# EAGLE schematic SystemeAlarme (EAGLE 6.5.0)
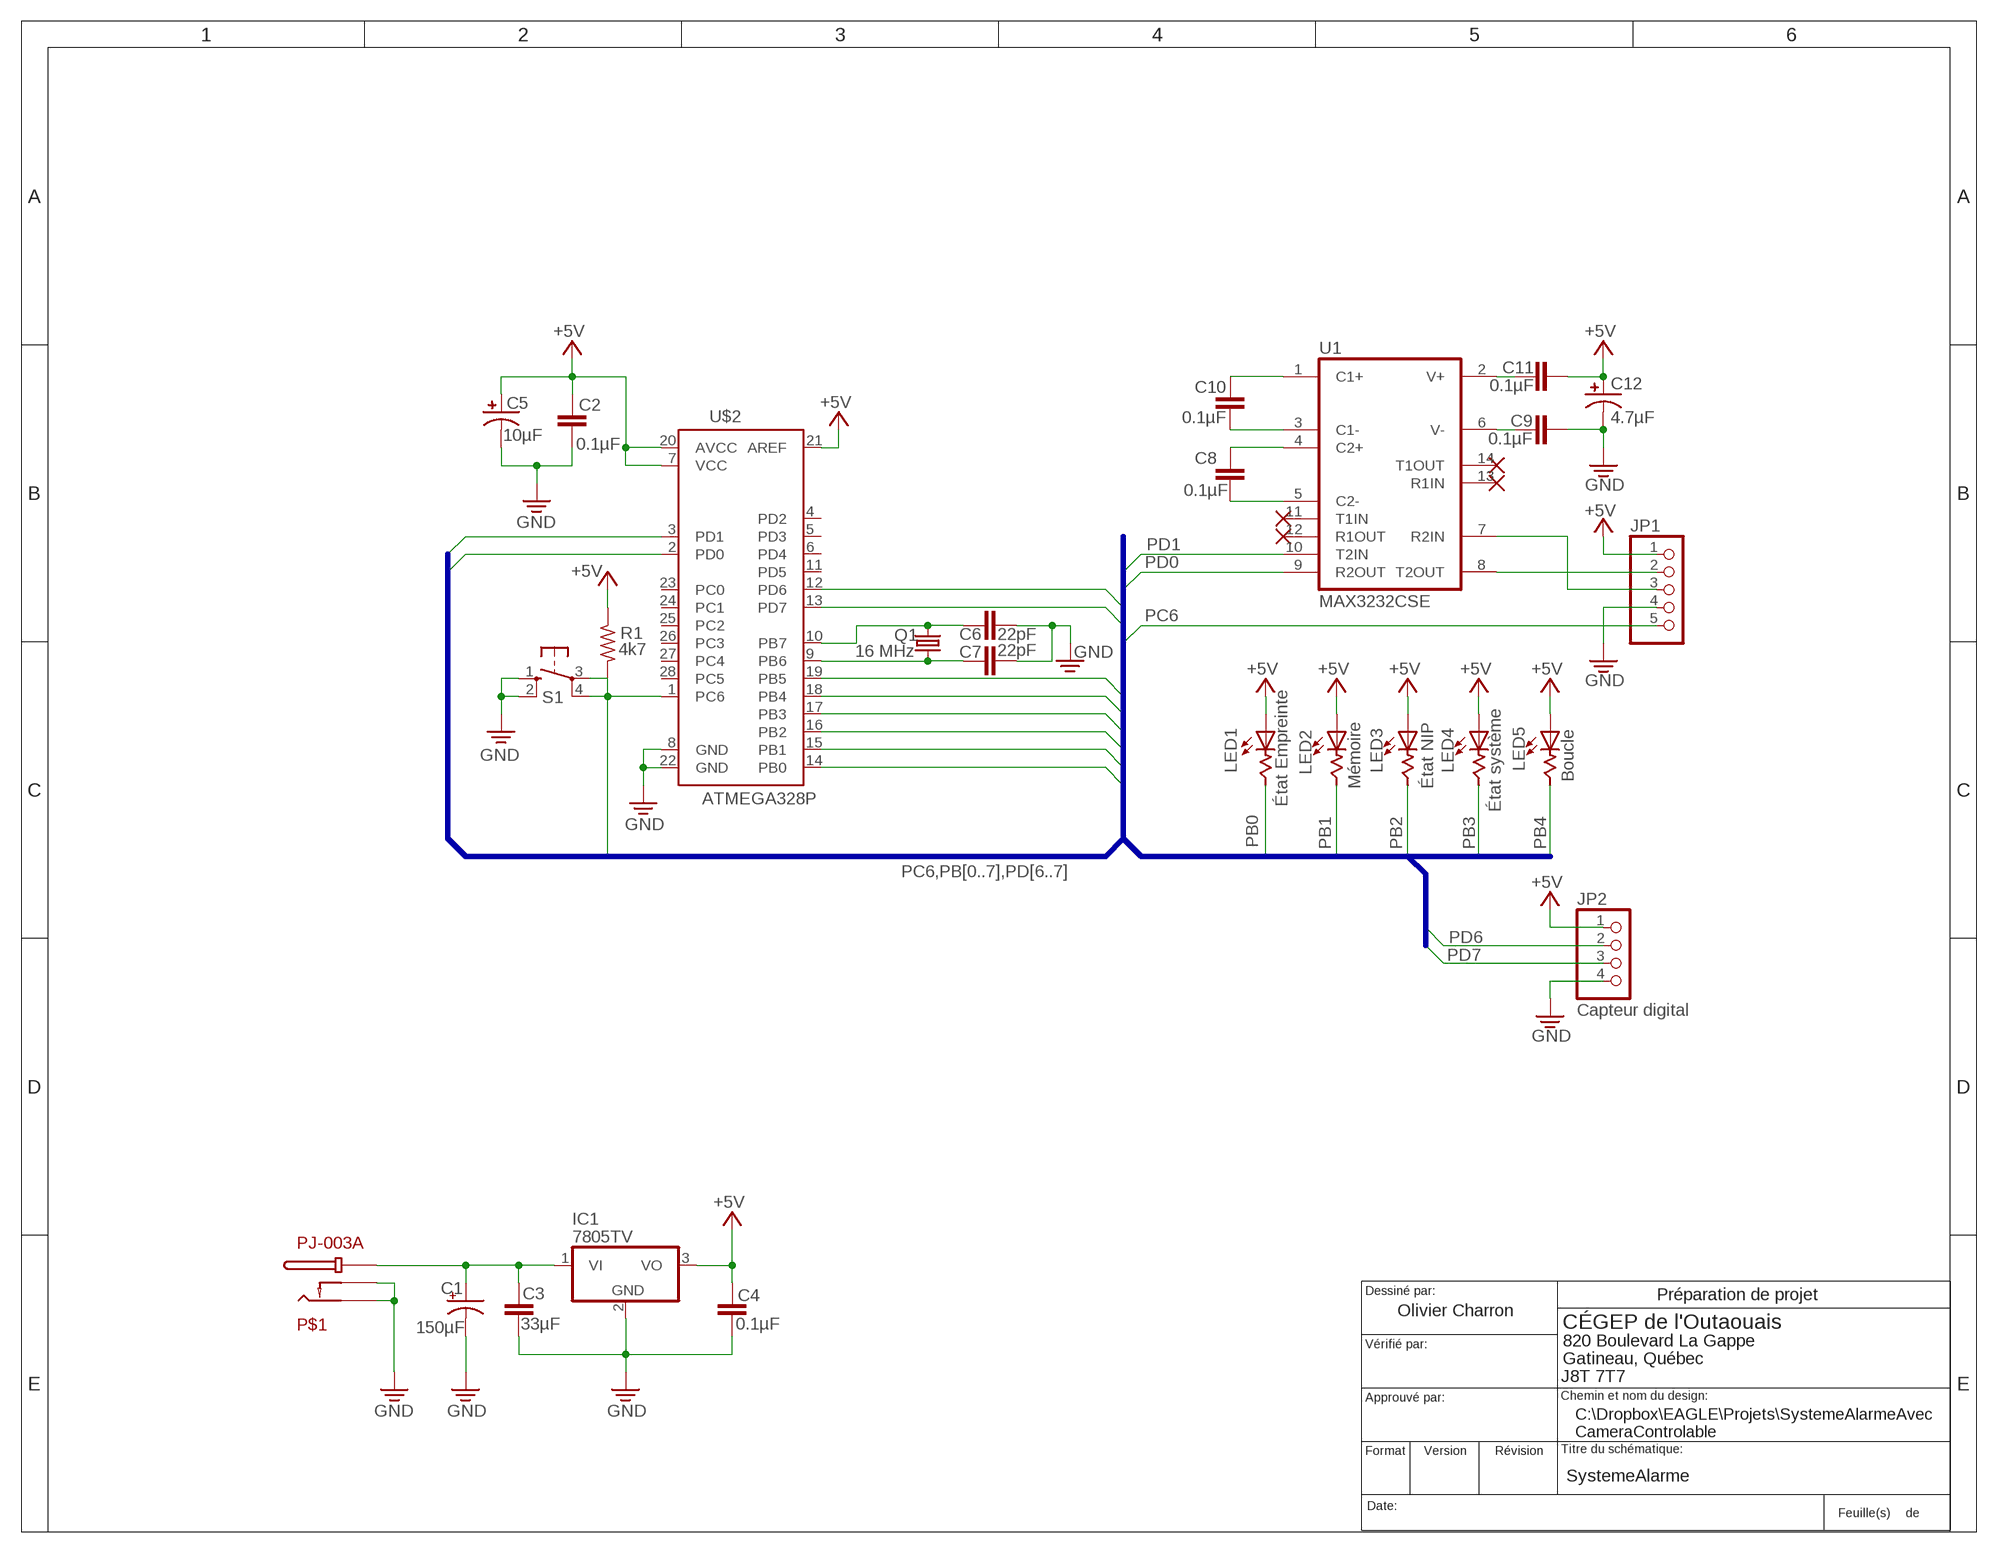
[diagram p0: schematic, sheet 1]

## Parts
C1  150µF  CPOL-USD/7343-31R  [D/7343-31R]
C2  0.1µF  C-EUC1210  [C1210]
C3  33µF  C-EUC0805  [C0805]
C4  0.1µF  C-EUC0805  [C0805]
C5  10µF  C-USC1206  [C1206]
C6  22pF  C-EUC1210  [C1210]
C7  22pF  C-EUC1210  [C1210]
C8  0.1µF  C-EUC0805  [C0805]
C9  0.1µF  C-EUC0805  [C0805]
C10  0.1µF  C-EUC0805  [C0805]
C11  0.1µF  C-EUC0805  [C0805]
C12  4.7µF  C-USC0805  [C0805]
FRAME1  CARTOUCHE_TGÉ  [CARTOUCHE]
IC1  7805TV  [TO220V]
JP1  PINHD-1X5  [1X05]
JP2  Capteur digital  PINHD-1X4  [1X04]
LED1  État Empreinte  LED3MM  [LED3MM]
LED2  Mémoire  LED3MM  [LED3MM]
LED3  État NIP  LED3MM  [LED3MM]
LED4  État système  LED3MM  [LED3MM]
LED5  Boucle  LED3MM  [LED3MM]
P$1  PJ-003A  [PJ-003A-FP]
Q1  16 MHz  CRYSTALHC49S  [HC49/S]
R1  4k7  R-US_M1206  [M1206]
S1  10-XX  [B3F-10XX]
U1  MAX3232CSE  [SO16]
U$2  ATMEGA328P  [DIL32]

## Nets
+5V: C2.2 C4.1 C5.1 C11.1 C12.1 IC1.3(VO) JP1.1 JP2.1 LED1.A LED2.A LED3.A LED4.A LED5.A R1.1 U$2.7(VCC) U$2.20(AVCC) U$2.21(AREF)
GND: C1.- C3.2 C4.2 C6.1 C7.1 C9.2 C12.2 IC1.2(GND) JP1.4 P$1.P$2(GND) P$1.P$3(GND) S1.1(S) S1.2(S1) U$2.8(GND) U$2.22(GND)
N$1: C1.+ C3.1 IC1.1(VI) P$1.P$1(+DCIN)
N$6: C10.1 U1.1(C1+)
N$7: C10.2 U1.3(C1-)
N$8: C8.1 U1.4(C2+)
N$9: C8.2 U1.5(C2-)
N$10: C9.1 U1.6(V-)
N$11: C11.2 U1.2(V+)
N$12: JP1.3 U1.7(R2IN)
N$20: JP1.2 U1.8(T2OUT)
N$22: C2.1 C5.2 ; supply symbol labelled GND
N$25: C6.2 Q1.1 U$2.10(PB7)
N$26: C7.2 Q1.2 U$2.9(PB6)
PB0: LED1.K(C) U$2.14(PB0)
PB1: LED2.K(C) U$2.15(PB1)
PB2: LED3.K(C) U$2.16(PB2)
PB3: LED4.K(C) U$2.17(PB3)
PB4: LED5.K(C) U$2.18(PB4)
PB5: U$2.19(PB5)
PC6: JP1.5 R1.2 S1.3(P) S1.4(P1) U$2.1(PC6)
PD0: U1.9(R2OUT) U$2.2(PD0)
PD1: U1.10(T2IN) U$2.3(PD1)
PD6: JP2.2 U$2.12(PD6)
PD7: JP2.3 U$2.13(PD7)
PE: JP2.4 ; supply symbol labelled GND
Unconnected: U1.11(T1IN) U1.12(R1OUT) U1.13(R1IN) U1.14(T1OUT) U$2.4(PD2) U$2.5(PD3) U$2.6(PD4) U$2.11(PD5) U$2.23(PC0) U$2.24(PC1) U$2.25(PC2) U$2.26(PC3) U$2.27(PC4) U$2.28(PC5)

## Buses
PC6,PB[0..7],PD[6..7]

## Notes on the sheet
- Écran tactile
- Capteur magnétique | Indicateurs lumineux
- Microcontrôleur | Tourelle
- Interrupteur
       à clé
- Sirène
- Lecteur d'empreinte 
           digitale
- Joystick
- Moniteur
- Ordinateur
- Caméra
- Préparation de projet
- C:\\Dropbox\\EAGLE\\Projets\\SystemeAlarmeAvec
  CameraControlable

## Power pins joined to a net without a drawn wire
GND: U1.15(GND)
VCC: U1.16(VCC)

## Library data of the parts
C1 = rcl:CPOL-US: POLARIZED CAPACITOR, American symbol
C2-C4 C6-C11 = rcl:C-EU: CAPACITOR, European symbol
C5 C12 = rcl:C-US: CAPACITOR, American symbol
FRAME1 = 1_TGE-sur G:CARTOUCHE_TGÉ: Cartouche de TGÉ: Grandeur A, dimention 8 1/2 x 11 pouces, orientation portrait. Les élèves doivent utiliser la commande TEXT pour placer les valeurs aux champs appropriés. Couche 100 Cartouche, ne pas oublier de créer cette couche! Size par défaut: 0,07 ou ajusté en conséquence si pas asez d'espace. Ratio: 8% Font: Vector. Voir la commande TEXT pour plus d'information.
IC1 = linear:78*: Positive VOLTAGE REGULATOR Source: http://cache.national.com/ds/LM/LM78L05.pdf http://www.fairchildsemi.com/ds/LM/LM7805.pdf
JP1 = pinhead:PINHD-1X5: PIN HEADER
JP2 = 1mylib:PINHD-1X4: PIN HEADER
LED1-LED5 = led:LED: LED OSRAM: - CHIPLED LG R971, LG N971, LY N971, LG Q971, LY Q971, LO R971, LY R971 LH N974, LH R974 LS Q976, LO Q976, LY Q976 LO Q996 - Hyper CHIPLED LW Q18S LB Q993, LB Q99A, LB R99A - SideLED LS A670, LO A670, LY A670, LG A670, LP A670 LB A673, LV A673, LT A673, LW A673 LH A674 LY A675 LS A676, LA A676, LO A676, LY A676, LW A676 LS A679, LY A679, LG A679 - Hyper Micro SIDELED® LS Y876, LA Y876, LO Y876, LY Y876 LT Y87S - SmartLED LW L88C, LW L88S LB L89C, LB L89S, LG L890 LS L89K, LO L89K, LY L89K LS L896, LA L896, LO L896, LY L896 - TOPLED LS T670, LO T670, LY T670, LG T670, LP T670 LSG T670, LSP T670, LSY T670, LOP T670, LYG T670 LG T671, LOG T671, LSG T671 LB T673, LV T673, LT T673, LW T673 LH T674 LS T676, LA T676, LO T676, LY T676, LB T676, LH T676, LSB T676, LW T676 LB T67C, LV T67C, LT T67C, LS T67K, LO T67K, LY T67K, LW E67C LS E67B, LA E67B, LO E67B, LY E67B, LB E67C, LV E67C, LT E67C LW T67C LS T679, LY T679, LG T679 LS T770, LO T770, LY T770, LG T770, LP T770 LB T773, LV T773, LT T773, LW T773 LH T774 LS E675, LA E675, LY E675, LS T675 LS T776, LA T776, LO T776, LY T776, LB T776 LHGB T686 LT T68C, LB T68C - Hyper Mini TOPLED® LB M676 - Mini TOPLED Santana® LG M470 LS M47K, LO M47K, LY M47K Source: http://www.osram.convergy.de LUXEON: - LUMILED® LXK2-PW12-R00, LXK2-PW12-S00, LXK2-PW14-U00, LXK2-PW14-V00 LXK2-PM12-R00, LXK2-PM12-S00, LXK2-PM14-U00 LXK2-PE12-Q00, LXK2-PE12-R00, LXK2-PE12-S00, LXK2-PE14-T00, LXK2-PE14-U00 LXK2-PB12-K00, LXK2-PB12-L00, LXK2-PB12-M00, LXK2-PB14-N00, LXK2-PB14-P00, LXK2-PB14-Q00 LXK2-PR12-L00, LXK2-PR12-M00, LXK2-PR14-Q00, LXK2-PR14-R00 LXK2-PD12-Q00, LXK2-PD12-R00, LXK2-PD12-S00 LXK2-PH12-R00, LXK2-PH12-S00 LXK2-PL12-P00, LXK2-PL12-Q00, LXK2-PL12-R00 Source: www.luxeon.com KINGBRIGHT: KA-3528ASYC Source: www.kingbright.com
P$1 = 1mylib:PJ-003A
Q1 = crystal:CRYSTAL: CRYSTAL; OC_FARNELL: 1667008; OC_NEWARK: unknown
R1 = rcl:R-US_: RESISTOR, American symbol
S1 = switch-omron:10-XX: OMRON SWITCH; MPN: B3F-1000; OC_FARNELL: 176432; OC_NEWARK: 36M3542
U1 = 1_TGE-sur G:MAX3232*: True RS-232 Transceivers 3.0V to 5.5V, Low-Power up to 1Mbps, Using Four 0.1µF External Capacitors Source: http://pdfserv.maxim-ic.com/en/ds/MAX3222-MAX3241.pdf; MPN: MAX3232CSE; OC_FARNELL: 9725490; OC_NEWARK: 90C2890
U$2 = SystemeAlarmeCameraController:ATMEGA328P